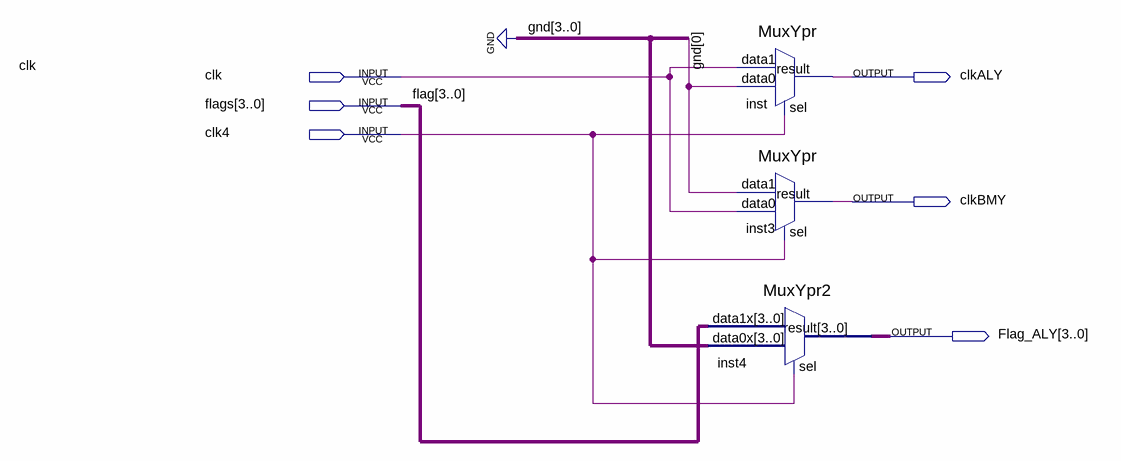
[diagram p0: schematic sheet]
// Quartus schematic BlokYprExem.bdf as structural Verilog: 3 symbols, 6 pins
module BlokYprExem (
  input  clk,
  input  [3:0] flags,
  input  clk4,
  output clkALY,
  output clkBMY,
  output [3:0] Flag_ALY
);

  MuxYpr2 inst4 (.data1x(flags), .data0x(4'b0000), .sel(clk4), .result(Flag_ALY));
  MuxYpr inst (.data1(clk), .data0(1'b0), .sel(clk4), .result(clkALY));
  MuxYpr inst3 (.data1(1'b0), .data0(clk), .sel(clk4), .result(clkBMY));

  // Other names for the same wires on the sheet: flag[3:0] = flags
endmodule
